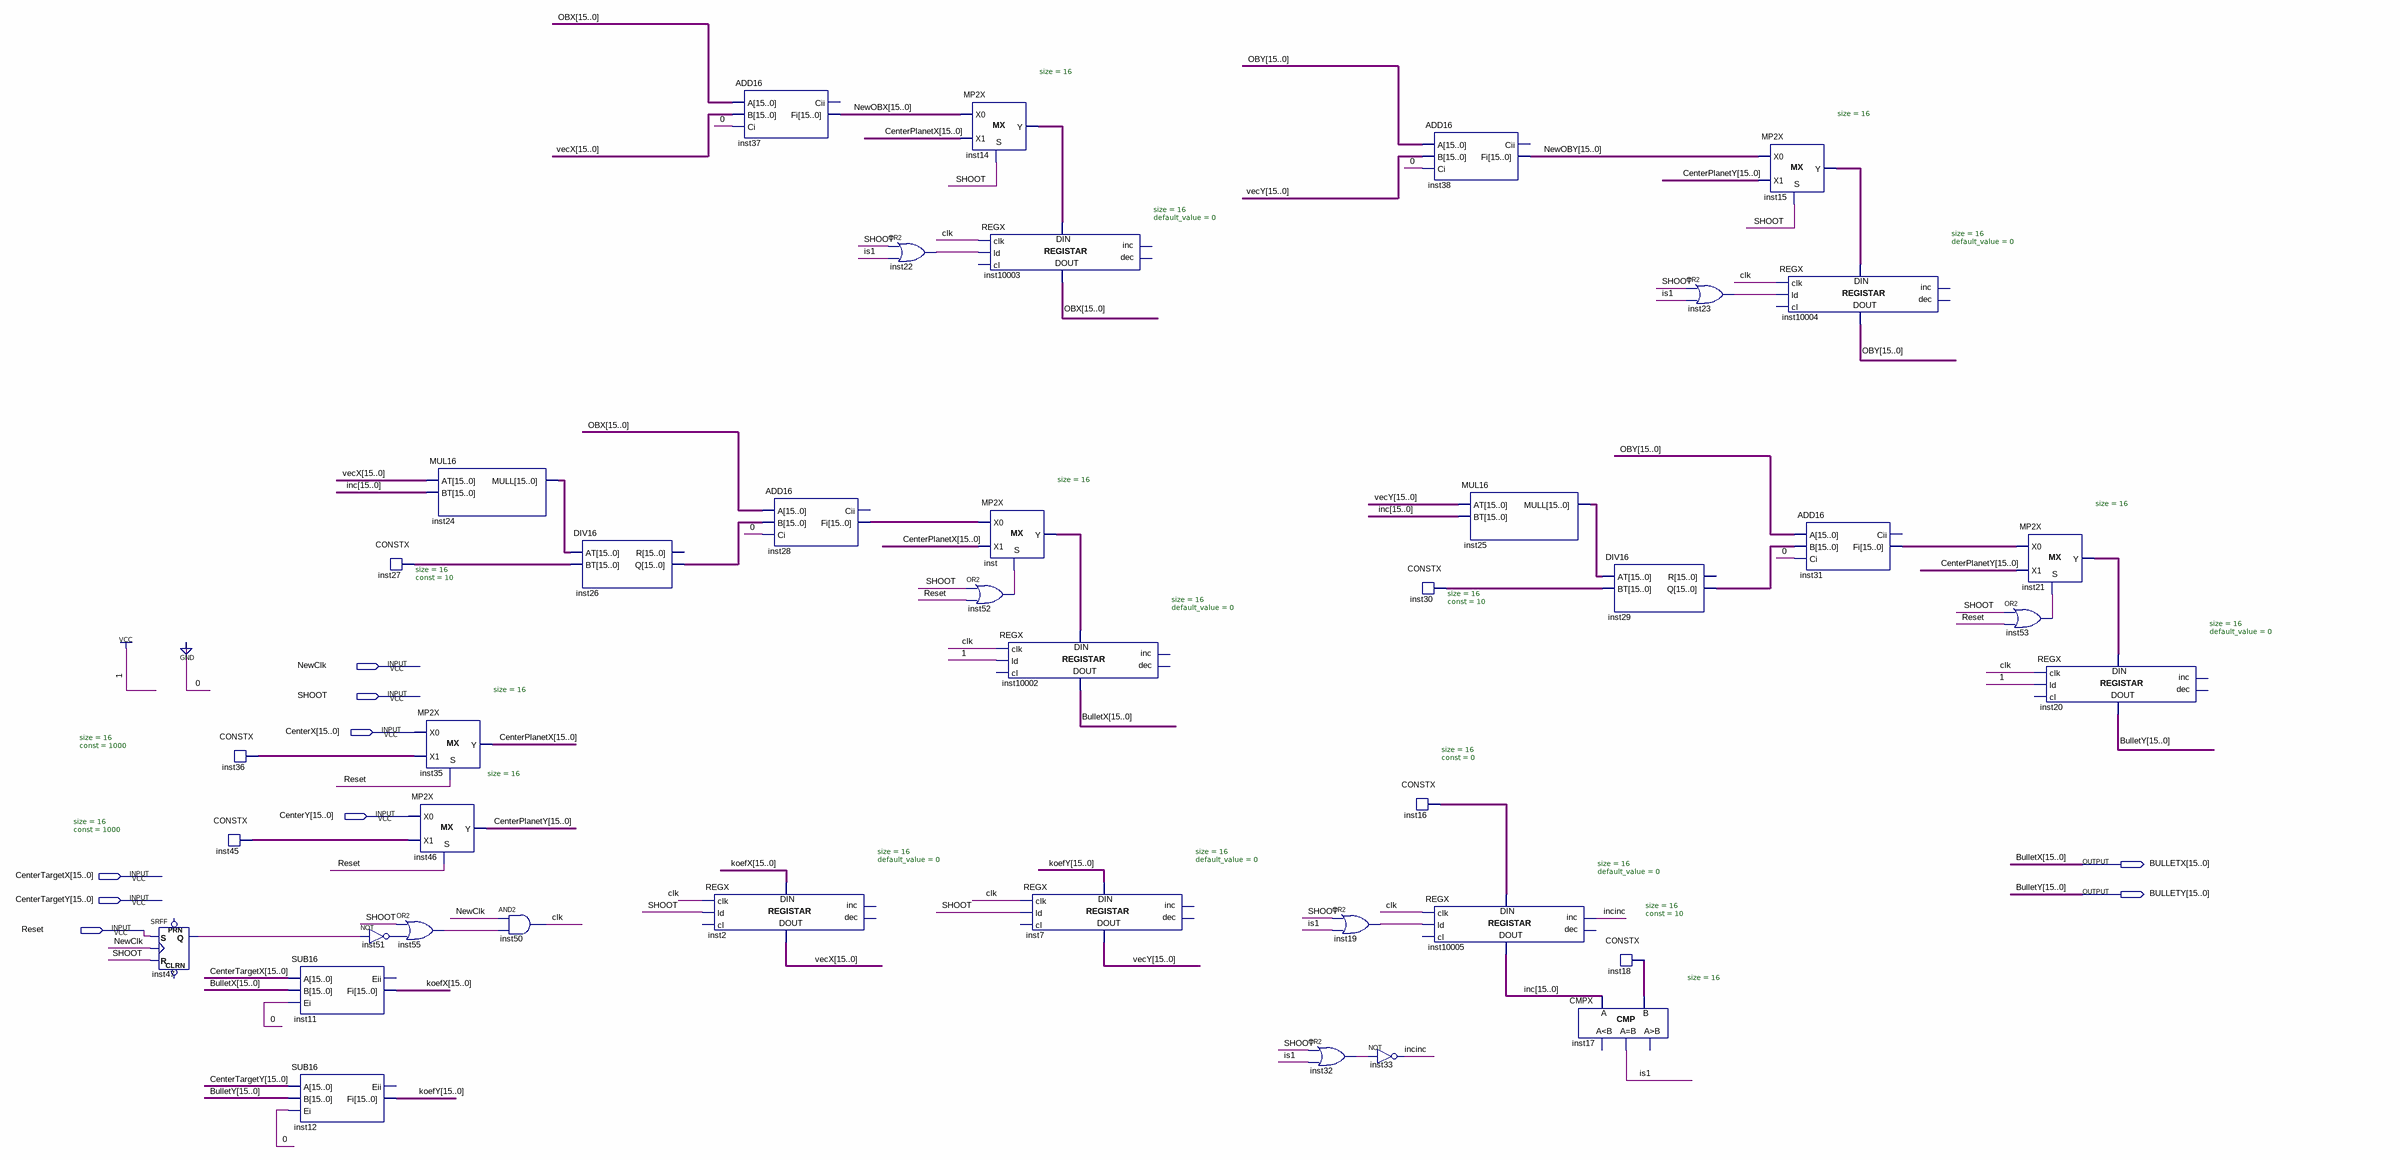
[diagram p0: schematic sheet]
// Quartus schematic bulletReg.bdf as structural Verilog: 41 symbols, 9 pins
module bulletReg (
  input  NewClk,
  input  SHOOT,
  input  [15:0] CenterX,
  input  [15:0] CenterY,
  input  [15:0] CenterTargetX,
  input  [15:0] CenterTargetY,
  input  Reset,
  output [15:0] BULLETX,
  output [15:0] BULLETY
);

  wire clk, incinc, inst19_out, inst22_out, inst23_out, inst32_out, inst47_q, inst51_out, inst52_out,
       inst53_out, inst55_out, is1;
  wire [15:0] CenterPlanetX, CenterPlanetY, inc, inst14_y, inst15_y, inst16_data, inst18_data, inst21_y,
       inst24_mull, inst25_mull, inst26_q, inst27_data, inst28_fi, inst29_q, inst30_data, inst31_fi,
       inst36_data, inst45_data, inst_y, koefX, koefY, NewOBX, NewOBY, OBX, OBY, vecX, vecY;

  SRFF inst47 (.S(Reset), .R(SHOOT), .CLK(NewClk), .Q(inst47_q));  // open: PRN, CLRN
  CONSTX #(.size(16), .\const (1000)) inst36 (.data(inst36_data));
  CONSTX #(.size(16), .\const (1000)) inst45 (.data(inst45_data));
  SUB16 inst11 (.A(CenterTargetX), .B(BULLETX), .Ei(1'b0), .Fi(koefX));  // open: Eii
  SUB16 inst12 (.A(CenterTargetY), .B(BULLETY), .Ei(1'b0), .Fi(koefY));  // open: Eii
  CONSTX #(.size(16), .\const (10)) inst27 (.data(inst27_data));
  not inst51 (inst51_out, inst47_q);
  MUL16 inst24 (.AT(vecX), .BT(inc), .MULL(inst24_mull));
  MP2X #(.size(16)) inst35 (.S(Reset), .X0(CenterX), .X1(inst36_data), .Y(CenterPlanetX));
  MP2X #(.size(16)) inst46 (.S(Reset), .X0(CenterY), .X1(inst45_data), .Y(CenterPlanetY));
  or inst55 (inst55_out, SHOOT, inst51_out);
  and inst50 (clk, NewClk, inst55_out);
  DIV16 inst26 (.AT(inst24_mull), .BT(inst27_data), .Q(inst26_q));  // open: R
  REGX #(.size(16), .default_value(0)) inst2 (
    .clk(clk), .ld(SHOOT), .data_in(koefX), .data_out(vecX));  // open: cl, inc, dec
  ADD16 inst37 (.A(OBX), .B(vecX), .Ci(1'b0), .Fi(NewOBX));  // open: Cii
  ADD16 inst28 (.A(OBX), .B(inst26_q), .Ci(1'b0), .Fi(inst28_fi));  // open: Cii
  or inst22 (inst22_out, SHOOT, is1);
  MP2X #(.size(16)) inst14 (.S(SHOOT), .X0(NewOBX), .X1(CenterPlanetX), .Y(inst14_y));
  or inst52 (inst52_out, SHOOT, Reset);
  REGX #(.size(16), .default_value(0)) inst10003 (
    .clk(clk), .ld(inst22_out), .data_in(inst14_y), .data_out(OBX));  // open: cl, inc, dec
  MP2X #(.size(16)) inst (.S(inst52_out), .X0(inst28_fi), .X1(CenterPlanetX), .Y(inst_y));
  REGX #(.size(16), .default_value(0)) inst10002 (
    .clk(clk), .ld(1'b1), .data_in(inst_y), .data_out(BULLETX));  // open: cl, inc, dec
  REGX #(.size(16), .default_value(0)) inst7 (
    .clk(clk), .ld(SHOOT), .data_in(koefY), .data_out(vecY));  // open: cl, inc, dec
  or inst19 (inst19_out, SHOOT, is1);
  or inst32 (inst32_out, SHOOT, is1);
  CONSTX #(.size(16), .\const (0)) inst16 (.data(inst16_data));
  not inst33 (incinc, inst32_out);
  ADD16 inst38 (.A(OBY), .B(vecY), .Ci(1'b0), .Fi(NewOBY));  // open: Cii
  CONSTX #(.size(16), .\const (10)) inst30 (.data(inst30_data));
  REGX #(.size(16), .default_value(0)) inst10005 (
    .clk(clk), .ld(inst19_out), .inc(incinc), .data_in(inst16_data), .data_out(inc));  // open: cl, dec
  MUL16 inst25 (.AT(vecY), .BT(inc), .MULL(inst25_mull));
  CMPX #(.size(16)) inst17 (.A(inc), .B(inst18_data), .eq(is1));  // open: ls, gr
  DIV16 inst29 (.AT(inst25_mull), .BT(inst30_data), .Q(inst29_q));  // open: R
  CONSTX #(.size(16), .\const (10)) inst18 (.data(inst18_data));
  or inst23 (inst23_out, SHOOT, is1);
  MP2X #(.size(16)) inst15 (.S(SHOOT), .X0(NewOBY), .X1(CenterPlanetY), .Y(inst15_y));
  REGX #(.size(16), .default_value(0)) inst10004 (
    .clk(clk), .ld(inst23_out), .data_in(inst15_y), .data_out(OBY));  // open: cl, inc, dec
  ADD16 inst31 (.A(OBY), .B(inst29_q), .Ci(1'b0), .Fi(inst31_fi));  // open: Cii
  MP2X #(.size(16)) inst21 (.S(inst53_out), .X0(inst31_fi), .X1(CenterPlanetY), .Y(inst21_y));
  or inst53 (inst53_out, SHOOT, Reset);
  REGX #(.size(16), .default_value(0)) inst20 (
    .clk(clk), .ld(1'b1), .data_in(inst21_y), .data_out(BULLETY));  // open: cl, inc, dec
endmodule
